# Altium project Mako DSP.PrjPCB (part 2 of 2)
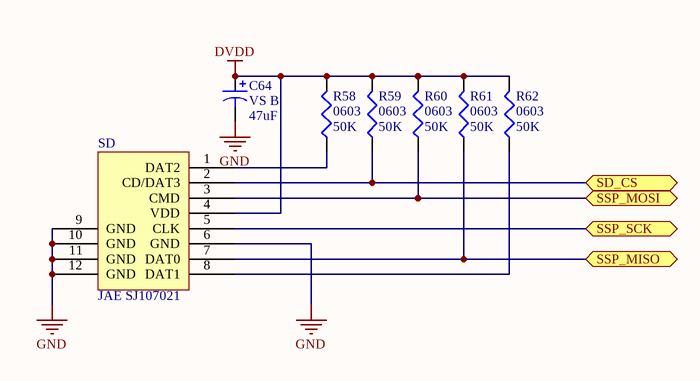
[diagram p9: Mako DSP SD Card and MIDI R2.1.SchDoc]

## Nets that join several sheets
5VCC: Mako DSP Power R2.1 (16 pins), Mako DSP Arduio IO R2.1 (Power_&_Reset1.5)
AVDD: Mako DSP Power R2.1 (C57.1 C58.1 U7.1), Mako DSP Audio Codec R2.1 (6 pins), Mako DSP Main R2.1 (FB5.1), Mako DSP Arduio IO R2.1 (13 pins)
DVDD: Mako DSP Power R2.1 (6 pins), Mako DSP Audio Codec R2.1 (7 pins), Mako DSP Main R2.1 (48 pins), Mako DSP Arduio IO R2.1 (Power_&_Reset1.2 Power_&_Reset1.4), Mako DSP Memory R2.1 (21 pins), Mako DSP QuadFlash and Boot R2.1 (6 pins), Mako DSP SD Card and MIDI R2.1 (7 pins)
GND: Mako DSP Power R2.1 (41 pins), Mako DSP Audio Codec R2.1 (24 pins), Mako DSP Main R2.1 (62 pins), Mako DSP Arduio IO R2.1 (9 pins), Mako DSP USB R2.1 (6 pins), Mako DSP Memory R2.1 (21 pins), Mako DSP QuadFlash and Boot R2.1 (6 pins), Mako DSP SD Card and MIDI R2.1 (6 pins)
VIN: Mako DSP Power R2.1 (13 pins), Mako DSP Arduio IO R2.1 (Power_&_Reset1.8)
ADC_RX_MCLK: Mako DSP Audio Codec R2.1 (U4.9), Mako DSP Main R2.1 (U5.M11)
ADC_RX_SCK: Mako DSP Audio Codec R2.1 (U4.8), Mako DSP Main R2.1 (U5.F13)
ADC_RX_SDA: Mako DSP Audio Codec R2.1 (U4.10), Mako DSP Main R2.1 (U5.F11)
ADC_RX_WS: Mako DSP Audio Codec R2.1 (U4.11), Mako DSP Main R2.1 (U5.G11)
BA0: Mako DSP Main R2.1 (U5.P15), Mako DSP Memory R2.1 (U12.G7)
BA1: Mako DSP Main R2.1 (U5.N11), Mako DSP Memory R2.1 (U12.G8)
CAS#: Mako DSP Main R2.1 (U5.R16), Mako DSP Memory R2.1 (U12.F7)
CKE: Mako DSP Main R2.1 (U5.H12), Mako DSP Memory R2.1 (U12.F3)
CLK: Mako DSP Main R2.1 (U5.T10), Mako DSP Memory R2.1 (U12.F2)
CS#: Mako DSP Main R2.1 (U5.R5), Mako DSP Memory R2.1 (U12.G9)
DAC_TX_MLCK: Mako DSP Audio Codec R2.1 (U4.5), Mako DSP Main R2.1 (U5.D14)
DAC_TX_SCK: Mako DSP Audio Codec R2.1 (U4.4), Mako DSP Main R2.1 (U5.H4)
DAC_TX_SDA: Mako DSP Audio Codec R2.1 (U4.6), Mako DSP Main R2.1 (U5.N8)
DAC_TX_WS: Mako DSP Audio Codec R2.1 (U4.7), Mako DSP Main R2.1 (U5.C14)
EMC_A0: Mako DSP Main R2.1 (U5.H16), Mako DSP Memory R2.1 (RA1.1)
EMC_A1: Mako DSP Main R2.1 (U5.G16), Mako DSP Memory R2.1 (RA1.2)
EMC_A2: Mako DSP Main R2.1 (U5.F16), Mako DSP Memory R2.1 (RA1.3)
EMC_A3: Mako DSP Main R2.1 (U5.E15), Mako DSP Memory R2.1 (RA1.4)
EMC_A4: Mako DSP Main R2.1 (U5.C16), Mako DSP Memory R2.1 (RA3.1)
EMC_A5: Mako DSP Main R2.1 (U5.P2), Mako DSP Memory R2.1 (RA3.2)
EMC_A6: Mako DSP Main R2.1 (U5.R2), Mako DSP Memory R2.1 (RA3.3)
EMC_A7: Mako DSP Main R2.1 (U5.R3), Mako DSP Memory R2.1 (RA3.4)
EMC_A8: Mako DSP Main R2.1 (U5.J16), Mako DSP Memory R2.1 (RA5.1)
EMC_A9: Mako DSP Main R2.1 (U5.H14), Mako DSP Memory R2.1 (RA5.2)
EMC_A10: Mako DSP Main R2.1 (U5.K16), Mako DSP Memory R2.1 (RA5.3)
EMC_A11: Mako DSP Main R2.1 (U5.M15), Mako DSP Memory R2.1 (RA5.4)
EMC_DQ0: Mako DSP Main R2.1 (U5.T5), Mako DSP Memory R2.1 (RA2.8)
EMC_DQ1: Mako DSP Main R2.1 (U5.T7), Mako DSP Memory R2.1 (RA2.6)
EMC_DQ2: Mako DSP Main R2.1 (U5.R8), Mako DSP Memory R2.1 (RA2.5)
EMC_DQ3: Mako DSP Main R2.1 (U5.T9), Mako DSP Memory R2.1 (RA2.7)
EMC_DQ4: Mako DSP Main R2.1 (U5.R9), Mako DSP Memory R2.1 (RA4.8)
EMC_DQ5: Mako DSP Main R2.1 (U5.R10), Mako DSP Memory R2.1 (RA4.6)
EMC_DQ6: Mako DSP Main R2.1 (U5.R11), Mako DSP Memory R2.1 (RA4.5)
EMC_DQ7: Mako DSP Main R2.1 (U5.P9), Mako DSP Memory R2.1 (RA4.7)
EMC_DQ8: Mako DSP Main R2.1 (U5.P10), Mako DSP Memory R2.1 (RA6.8)
EMC_DQ9: Mako DSP Main R2.1 (U5.T13), Mako DSP Memory R2.1 (RA6.6)
EMC_DQ10: Mako DSP Main R2.1 (U5.R12), Mako DSP Memory R2.1 (RA6.5)
EMC_DQ11: Mako DSP Main R2.1 (U5.N3), Mako DSP Memory R2.1 (RA6.7)
EMC_DQ12: Mako DSP Main R2.1 (U5.P3), Mako DSP Memory R2.1 (RA7.8)
EMC_DQ13: Mako DSP Main R2.1 (U5.R4), Mako DSP Memory R2.1 (RA7.6)
EMC_DQ14: Mako DSP Main R2.1 (U5.T8), Mako DSP Memory R2.1 (RA7.5)
EMC_DQ15: Mako DSP Main R2.1 (U5.R1), Mako DSP Memory R2.1 (RA7.7)
I2C_CLK: Mako DSP Audio Codec R2.1 (R1.1 U4.17), Mako DSP Main R2.1 (U5.L15)
I2C_Data: Mako DSP Audio Codec R2.1 (R2.1 U4.16), Mako DSP Main R2.1 (U5.L16)
Latch_Enable: Mako DSP Audio Codec R2.1 (U4.15), Mako DSP Main R2.1 (U5.L14)
LDQM: Mako DSP Main R2.1 (U5.G15), Mako DSP Memory R2.1 (U12.E8)
MODE: Mako DSP Audio Codec R2.1 (U4.14), Mako DSP Main R2.1 (U5.L13)
NetJ3_4: Mako DSP Main R2.1 (U5.H2), Mako DSP USB R2.1 (J3.4)
NetQ1_3: Mako DSP Power R2.1 (Q1.3), Mako DSP Main R2.1 (U5.F1), Mako DSP USB R2.1 (R27.2)
NetR6_2: Mako DSP Audio Codec R2.1 (R6.2 U4.2), Mako DSP Main R2.1 (U5.J13)
NetR7_2: Mako DSP Audio Codec R2.1 (R7.2 U4.3), Mako DSP Main R2.1 (U5.H13)
NetR34_2: Mako DSP Main R2.1 (U5.B3), Mako DSP Arduio IO R2.1 (R34.2 U1.1 U1.2)
NetR35_2: Mako DSP Main R2.1 (U5.A4), Mako DSP Arduio IO R2.1 (R35.2 U1.4 U1.5)
NetR36_2: Mako DSP Main R2.1 (U5.C3), Mako DSP Arduio IO R2.1 (R36.2 U2.1 U2.2)
NetR37_2: Mako DSP Main R2.1 (U5.C6), Mako DSP Arduio IO R2.1 (R37.2 U2.4 U2.5)
NetR38_2: Mako DSP Main R2.1 (U5.E3), Mako DSP Arduio IO R2.1 (R38.2 U3.1 U3.2)
NetR39_2: Mako DSP Main R2.1 (U5.B5), Mako DSP Arduio IO R2.1 (R39.2 U3.4 U3.5)
NetU5_A15: Mako DSP Main R2.1 (U5.A15), Mako DSP QuadFlash and Boot R2.1 (U10.D4)
NetU5_B13: Mako DSP Main R2.1 (U5.B13), Mako DSP QuadFlash and Boot R2.1 (U10.D2)
NetU5_B14: Mako DSP Main R2.1 (U5.B14), Mako DSP QuadFlash and Boot R2.1 (U10.B2)
NetU5_C10: Mako DSP Main R2.1 (U5.C10), Mako DSP QuadFlash and Boot R2.1 (U10.C2)
NetU5_C11: Mako DSP Main R2.1 (U5.C11), Mako DSP QuadFlash and Boot R2.1 (U10.D3)
NetU5_C12: Mako DSP Main R2.1 (U5.C12), Mako DSP QuadFlash and Boot R2.1 (U10.C4)
RAS#: Mako DSP Main R2.1 (U5.P16), Mako DSP Memory R2.1 (U12.F8)
RESET: Mako DSP Main R2.1 (5 pins), Mako DSP Arduio IO R2.1 (Power_&_Reset1.3)
Shield_SCL: Mako DSP Main R2.1 (U5.K11), Mako DSP Arduio IO R2.1 (Digital_IO_Higher_Byte1.1)
Shield_SDA: Mako DSP Main R2.1 (U5.J12), Mako DSP Arduio IO R2.1 (Digital_IO_Higher_Byte1.2)
SSP_MISO: Mako DSP Main R2.1 (SSP1.1), Mako DSP SD Card and MIDI R2.1 (R61.1 SD.7)
SSP_MOSI: Mako DSP Main R2.1 (SSP1.4 U5.M2), Mako DSP SD Card and MIDI R2.1 (R60.1 SD.3)
SSP_SCK: Mako DSP Main R2.1 (SSP1.3 U5.D10), Mako DSP SD Card and MIDI R2.1 (SD.5)
UDQM: Mako DSP Main R2.1 (U5.H15), Mako DSP Memory R2.1 (U12.F1)
USB0_N: Mako DSP Main R2.1 (U5.G2), Mako DSP USB R2.1 (J3.2 R33.1)
USB0_P: Mako DSP Main R2.1 (U5.F2), Mako DSP USB R2.1 (J3.3 R32.1)
WE#: Mako DSP Main R2.1 (U5.T4), Mako DSP Memory R2.1 (U12.F9)